# Altium schematic sheet BroidaSystem.SchDoc
size A
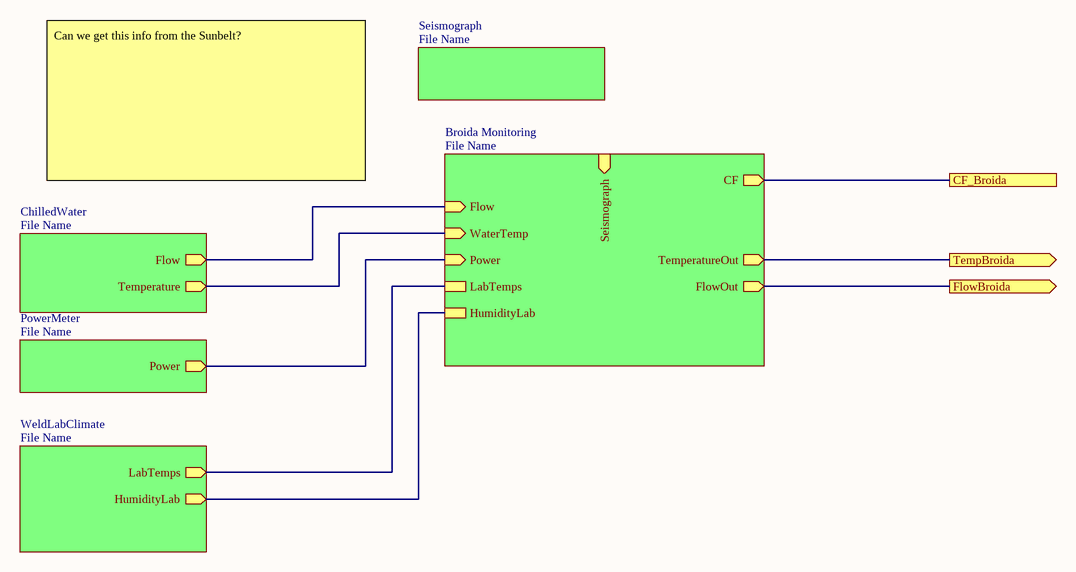
[diagram p0: BroidaSystem.SchDoc]

## Sub-sheets
Broida Monitoring = File Name: Flow (in), WaterTemp (in), CF (out), FlowOut (out), TemperatureOut (out), Power (in), Seismograph (in), LabTemps, HumidityLab
ChilledWater = File Name: Flow (out), Temperature (out)
PowerMeter = File Name: Power (out)
Seismograph = File Name: no entries
WeldLabClimate = File Name: LabTemps (out), HumidityLab (out)

## Ports
CF_Broida, FlowBroida (out), TempBroida (out)

## Nets
CF_Broida: port CF_Broida, sheet Broida Monitoring/CF
FlowBroida: port FlowBroida, sheet Broida Monitoring/FlowOut
TempBroida: port TempBroida, sheet Broida Monitoring/TemperatureOut
(unnamed): sheet Broida Monitoring/Flow, sheet ChilledWater/Flow
(unnamed): sheet Broida Monitoring/WaterTemp, sheet ChilledWater/Temperature
(unnamed): sheet Broida Monitoring/Power, sheet PowerMeter/Power
(unnamed): sheet Broida Monitoring/LabTemps, sheet WeldLabClimate/LabTemps
(unnamed): sheet Broida Monitoring/HumidityLab, sheet WeldLabClimate/HumidityLab

## Notes on the sheet
- Can we get this info from the Sunbelt?